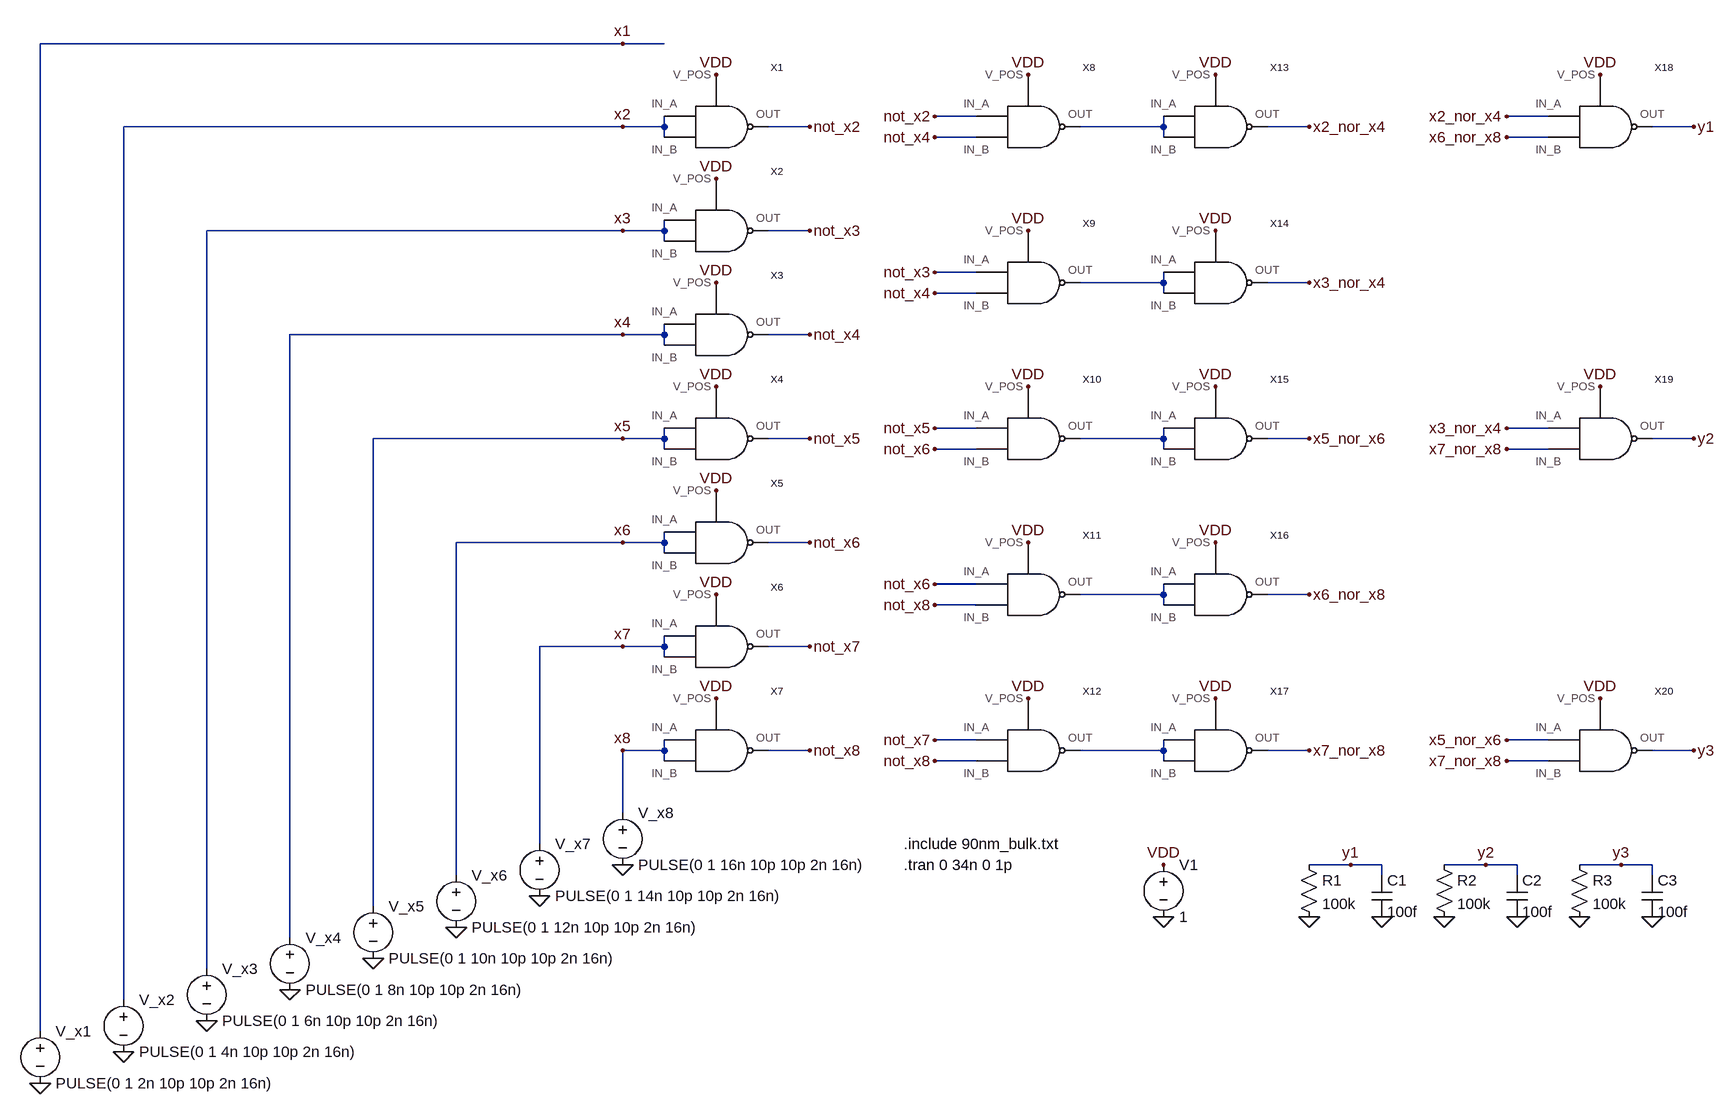
[diagram p0: schematic Draft1.asc]
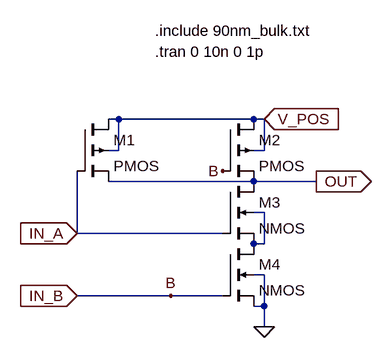
[diagram p1: sub-circuit nand.asc]
Draft1.asc, the LTspice schematic file:
Version 4
SHEET 1 2156 1812
WIRE 272 176 -624 176
WIRE 336 176 272 176
WIRE 816 288 752 288
WIRE 1696 288 1632 288
WIRE 272 304 -496 304
WIRE 336 304 336 288
WIRE 336 304 272 304
WIRE 560 304 496 304
WIRE 1104 304 1104 288
WIRE 1104 304 976 304
WIRE 1328 304 1264 304
WIRE 1920 304 1856 304
WIRE 336 320 336 304
WIRE 816 320 752 320
WIRE 1104 320 1104 304
WIRE 1696 320 1632 320
WIRE 272 464 -368 464
WIRE 336 464 336 448
WIRE 336 464 272 464
WIRE 560 464 496 464
WIRE 336 480 336 464
WIRE 816 528 752 528
WIRE 1104 544 1104 528
WIRE 1104 544 976 544
WIRE 1328 544 1264 544
WIRE 816 560 752 560
WIRE 1104 560 1104 544
WIRE 272 624 -240 624
WIRE 336 624 336 608
WIRE 336 624 272 624
WIRE 560 624 496 624
WIRE 336 640 336 624
WIRE 816 768 752 768
WIRE 1696 768 1632 768
WIRE 272 784 -112 784
WIRE 336 784 336 768
WIRE 336 784 272 784
WIRE 560 784 496 784
WIRE 1104 784 1104 768
WIRE 1104 784 976 784
WIRE 1328 784 1264 784
WIRE 1920 784 1856 784
WIRE 336 800 336 784
WIRE 816 800 752 800
WIRE 1104 800 1104 784
WIRE 1696 800 1632 800
WIRE 272 944 16 944
WIRE 336 944 336 928
WIRE 336 944 272 944
WIRE 560 944 496 944
WIRE 336 960 336 944
WIRE 816 1008 752 1008
WIRE 1104 1024 1104 1008
WIRE 1104 1024 976 1024
WIRE 1328 1024 1264 1024
WIRE 816 1040 752 1040
WIRE 1104 1040 1104 1024
WIRE 272 1104 144 1104
WIRE 336 1104 336 1088
WIRE 336 1104 272 1104
WIRE 560 1104 496 1104
WIRE 336 1120 336 1104
WIRE 816 1248 752 1248
WIRE 1696 1248 1632 1248
WIRE 336 1264 336 1248
WIRE 336 1264 272 1264
WIRE 560 1264 496 1264
WIRE 1104 1264 1104 1248
WIRE 1104 1264 976 1264
WIRE 1328 1264 1264 1264
WIRE 1920 1264 1856 1264
WIRE 336 1280 336 1264
WIRE 816 1280 752 1280
WIRE 1104 1280 1104 1264
WIRE 1696 1280 1632 1280
WIRE 272 1360 272 1264
WIRE 144 1408 144 1104
WIRE 1392 1440 1328 1440
WIRE 1440 1440 1392 1440
WIRE 1600 1440 1536 1440
WIRE 1648 1440 1600 1440
WIRE 1808 1440 1744 1440
WIRE 1856 1440 1808 1440
WIRE 16 1456 16 944
WIRE 1440 1456 1440 1440
WIRE 1648 1456 1648 1440
WIRE 1856 1456 1856 1440
WIRE -112 1504 -112 784
WIRE -240 1552 -240 624
WIRE -368 1600 -368 464
WIRE -496 1648 -496 304
WIRE -624 1696 -624 176
FLAG 1104 1520 0
FLAG 1104 1440 VDD
FLAG 416 224 VDD
FLAG 416 384 VDD
FLAG 416 544 VDD
FLAG 416 704 VDD
FLAG 416 864 VDD
FLAG 416 1024 VDD
FLAG 896 224 VDD
FLAG 896 464 VDD
FLAG 896 704 VDD
FLAG 896 944 VDD
FLAG 896 1184 VDD
FLAG 416 1184 VDD
FLAG 1184 224 VDD
FLAG 1184 464 VDD
FLAG 1184 704 VDD
FLAG 1184 944 VDD
FLAG 1184 1184 VDD
FLAG 1776 224 VDD
FLAG 1776 704 VDD
FLAG 1776 1184 VDD
FLAG 272 304 x2
FLAG 272 464 x3
FLAG 272 624 x4
FLAG 272 784 x5
FLAG 272 944 x6
FLAG 272 1104 x7
FLAG 272 1264 x8
FLAG 560 304 not_x2
FLAG 560 464 not_x3
FLAG 560 624 not_x4
FLAG 560 784 not_x5
FLAG 560 944 not_x6
FLAG 560 1104 not_x7
FLAG 560 1264 not_x8
FLAG 752 288 not_x2
FLAG 752 320 not_x4
FLAG 752 560 not_x4
FLAG 752 528 not_x3
FLAG 752 768 not_x5
FLAG 752 800 not_x6
FLAG 752 1280 not_x8
FLAG 752 1248 not_x7
FLAG 752 1008 not_x6
FLAG 752 1040 not_x8
FLAG 1328 304 x2_nor_x4
FLAG 1328 544 x3_nor_x4
FLAG 1328 784 x5_nor_x6
FLAG 1328 1024 x6_nor_x8
FLAG 1328 1264 x7_nor_x8
FLAG 1632 288 x2_nor_x4
FLAG 1632 320 x6_nor_x8
FLAG 1632 768 x3_nor_x4
FLAG 1632 800 x7_nor_x8
FLAG 1632 1248 x5_nor_x6
FLAG 1632 1280 x7_nor_x8
FLAG -624 1776 0
FLAG -496 1728 0
FLAG -368 1680 0
FLAG -240 1632 0
FLAG -112 1584 0
FLAG 16 1536 0
FLAG 144 1488 0
FLAG 272 1440 0
FLAG 1920 304 y1
FLAG 1920 784 y2
FLAG 1920 1264 y3
FLAG 1440 1520 0
FLAG 1328 1520 0
FLAG 1392 1440 y1
FLAG 1648 1520 0
FLAG 1536 1520 0
FLAG 1600 1440 y2
FLAG 1856 1520 0
FLAG 1744 1520 0
FLAG 1808 1440 y3
FLAG 272 176 x1
SYMBOL NAND 416 304 R0
SYMATTR InstName X1
SYMBOL NAND 416 464 R0
SYMATTR InstName X2
SYMBOL NAND 416 624 R0
SYMATTR InstName X3
SYMBOL NAND 416 784 R0
SYMATTR InstName X4
SYMBOL NAND 416 944 R0
SYMATTR InstName X5
SYMBOL NAND 416 1104 R0
SYMATTR InstName X6
SYMBOL NAND 416 1264 R0
SYMATTR InstName X7
SYMBOL NAND 896 304 R0
SYMATTR InstName X8
SYMBOL NAND 896 544 R0
SYMATTR InstName X9
SYMBOL NAND 896 784 R0
SYMATTR InstName X10
SYMBOL NAND 896 1024 R0
SYMATTR InstName X11
SYMBOL NAND 896 1264 R0
SYMATTR InstName X12
SYMBOL NAND 1184 304 R0
SYMATTR InstName X13
SYMBOL NAND 1184 544 R0
SYMATTR InstName X14
SYMBOL NAND 1184 784 R0
SYMATTR InstName X15
SYMBOL NAND 1184 1024 R0
SYMATTR InstName X16
SYMBOL NAND 1184 1264 R0
SYMATTR InstName X17
SYMBOL NAND 1776 304 R0
SYMATTR InstName X18
SYMBOL NAND 1776 784 R0
SYMATTR InstName X19
SYMBOL NAND 1776 1264 R0
SYMATTR InstName X20
SYMBOL voltage 1104 1424 R0
WINDOW 123 0 0 Left 0
WINDOW 39 0 0 Left 0
SYMATTR InstName V1
SYMATTR Value 1
SYMBOL voltage -624 1680 R0
WINDOW 123 0 0 Left 0
WINDOW 39 0 0 Left 0
SYMATTR InstName V_x1
SYMATTR Value PULSE(0 1 2n 10p 10p 2n 16n)
SYMBOL voltage -496 1632 R0
WINDOW 123 0 0 Left 0
WINDOW 39 0 0 Left 0
SYMATTR InstName V_x2
SYMATTR Value PULSE(0 1 4n 10p 10p 2n 16n)
SYMBOL voltage -368 1584 R0
WINDOW 123 0 0 Left 0
WINDOW 39 0 0 Left 0
SYMATTR InstName V_x3
SYMATTR Value PULSE(0 1 6n 10p 10p 2n 16n)
SYMBOL voltage -240 1536 R0
WINDOW 123 0 0 Left 0
WINDOW 39 0 0 Left 0
SYMATTR InstName V_x4
SYMATTR Value PULSE(0 1 8n 10p 10p 2n 16n)
SYMBOL voltage -112 1488 R0
WINDOW 123 0 0 Left 0
WINDOW 39 0 0 Left 0
SYMATTR InstName V_x5
SYMATTR Value PULSE(0 1 10n 10p 10p 2n 16n)
SYMBOL voltage 16 1440 R0
WINDOW 123 0 0 Left 0
WINDOW 39 0 0 Left 0
SYMATTR InstName V_x6
SYMATTR Value PULSE(0 1 12n 10p 10p 2n 16n)
SYMBOL voltage 144 1392 R0
WINDOW 123 0 0 Left 0
WINDOW 39 0 0 Left 0
SYMATTR InstName V_x7
SYMATTR Value PULSE(0 1 14n 10p 10p 2n 16n)
SYMBOL voltage 272 1344 R0
WINDOW 123 0 0 Left 0
WINDOW 39 0 0 Left 0
SYMATTR InstName V_x8
SYMATTR Value PULSE(0 1 16n 10p 10p 2n 16n)
SYMBOL res 1312 1424 R0
SYMATTR InstName R1
SYMATTR Value 100k
SYMBOL cap 1424 1456 R0
SYMATTR InstName C1
SYMATTR Value 100f
SYMBOL res 1520 1424 R0
SYMATTR InstName R2
SYMATTR Value 100k
SYMBOL cap 1632 1456 R0
SYMATTR InstName C2
SYMATTR Value 100f
SYMBOL res 1728 1424 R0
SYMATTR InstName R3
SYMATTR Value 100k
SYMBOL cap 1840 1456 R0
SYMATTR InstName C3
SYMATTR Value 100f
TEXT 704 1408 Left 2 !.include 90nm_bulk.txt
TEXT 704 1440 Left 2 !.tran 0 34n 0 1p

nand.asc, the sub-circuit schematic file:
Version 4
SHEET 1 1056 992
WIRE 368 176 352 176
WIRE 576 176 368 176
WIRE 592 176 576 176
WIRE 368 224 368 176
WIRE 368 224 352 224
WIRE 592 224 592 176
WIRE 592 224 576 224
WIRE 576 272 352 272
WIRE 672 272 576 272
WIRE 592 320 576 320
WIRE 304 352 304 256
WIRE 528 352 304 352
WIRE 592 368 592 320
WIRE 592 368 576 368
WIRE 592 416 576 416
WIRE 448 448 304 448
WIRE 528 448 448 448
WIRE 592 464 592 416
WIRE 592 464 576 464
WIRE 592 496 592 464
FLAG 592 496 0
FLAG 448 448 B
FLAG 528 256 B
FLAG 592 176 V_POS
IOPIN 592 176 In
FLAG 304 352 IN_A
IOPIN 304 352 In
FLAG 304 448 IN_B
IOPIN 304 448 In
FLAG 672 272 OUT
IOPIN 672 272 Out
SYMBOL pmos4 304 176 R0
SYMATTR InstName M1
SYMATTR Value2 l=90n w=400n
SYMBOL pmos4 528 176 R0
SYMATTR InstName M2
SYMATTR Value2 l=90n w=400n
SYMBOL nmos4 528 272 R0
SYMATTR InstName M3
SYMATTR Value2 l=90n w=200n
SYMBOL nmos4 528 368 R0
SYMATTR InstName M4
SYMATTR Value2 l=90n w=200n
TEXT 424 40 Left 2 !.include 90nm_bulk.txt
TEXT 424 72 Left 2 !.tran 0 10n 0 1p

The netlist it stands for:
* Draft1.asc
XX1 VDD x2 x2 not_x2 nand
XX2 VDD x3 x3 not_x3 nand
XX3 VDD x4 x4 not_x4 nand
XX4 VDD x5 x5 not_x5 nand
XX5 VDD x6 x6 not_x6 nand
XX6 VDD x7 x7 not_x7 nand
XX7 VDD x8 x8 not_x8 nand
XX8 VDD not_x2 not_x4 N001 nand
XX9 VDD not_x3 not_x4 N002 nand
XX10 VDD not_x5 not_x6 N003 nand
XX11 VDD not_x6 not_x8 N004 nand
XX12 VDD not_x7 not_x8 N005 nand
XX13 VDD N001 N001 x2_nor_x4 nand
XX14 VDD N002 N002 x3_nor_x4 nand
XX15 VDD N003 N003 x5_nor_x6 nand
XX16 VDD N004 N004 x6_nor_x8 nand
XX17 VDD N005 N005 x7_nor_x8 nand
XX18 VDD x2_nor_x4 x6_nor_x8 y1 nand
XX19 VDD x3_nor_x4 x7_nor_x8 y2 nand
XX20 VDD x5_nor_x6 x7_nor_x8 y3 nand
V1 VDD 0 1
V_x1 x1 0 PULSE(0 1 2n 10p 10p 2n 16n)
V_x2 x2 0 PULSE(0 1 4n 10p 10p 2n 16n)
V_x3 x3 0 PULSE(0 1 6n 10p 10p 2n 16n)
V_x4 x4 0 PULSE(0 1 8n 10p 10p 2n 16n)
V_x5 x5 0 PULSE(0 1 10n 10p 10p 2n 16n)
V_x6 x6 0 PULSE(0 1 12n 10p 10p 2n 16n)
V_x7 x7 0 PULSE(0 1 14n 10p 10p 2n 16n)
V_x8 x8 0 PULSE(0 1 16n 10p 10p 2n 16n)
R1 y1 0 100k
C1 y1 0 100f
R2 y2 0 100k
C2 y2 0 100f
R3 y3 0 100k
C3 y3 0 100f

* block symbol definitions
.subckt nand V_POS IN_A IN_B OUT
M1 V_POS IN_A OUT V_POS PMOS l=90n w=400n
M2 V_POS IN_B OUT V_POS PMOS l=90n w=400n
M3 OUT IN_A N001 N001 NMOS l=90n w=200n
M4 N001 IN_B 0 0 NMOS l=90n w=200n
.include 90nm_bulk.txt
.tran 0 10n 0 1p
.ends nand

.model NMOS NMOS
.model PMOS PMOS
.lib standard.mos
.include 90nm_bulk.txt
.tran 0 34n 0 1p
.backanno
.end

* Results of the author's LTspice run, read from the files saved beside the schematic
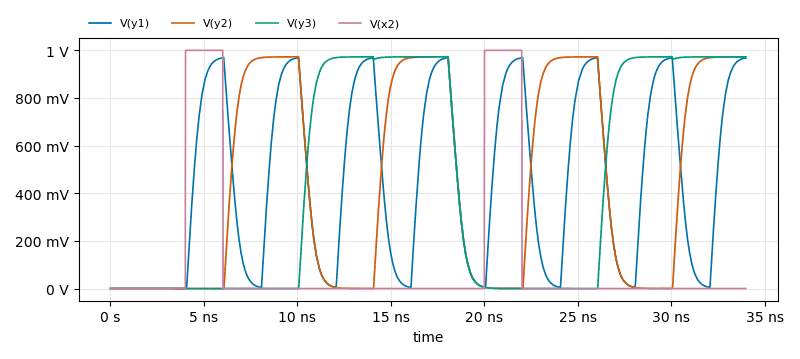
[diagram p2: Transient Analysis of Draft1.asc, plotted from the saved traces]
* Transient Analysis, 1 run:
*   V(y1): min -1.175 mV, max 970.7 mV, average 450.7 mV, rms 593.3 mV, last 968.6 mV
*   V(y2): min -1.175 mV, max 973.9 mV, average 446.1 mV, rms 627.3 mV, last 972.5 mV
*   V(y3): min -1.169 mV, max 973.8 mV, average 443.4 mV, rms 643.4 mV, last 972.5 mV
*   V(x2): min 0 V, max 1 V, average 118.2 mV, rms 343.6 mV, last 0 V